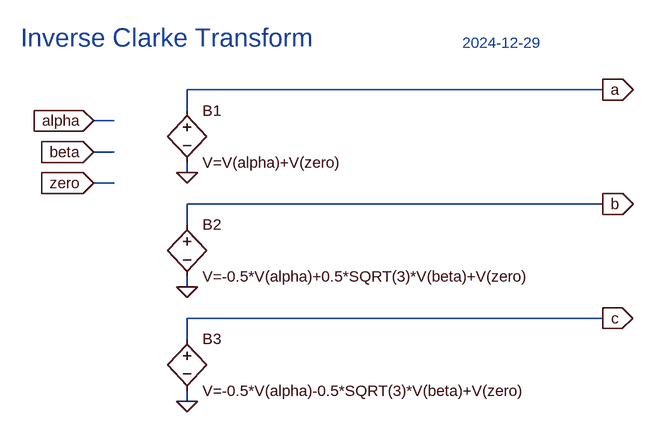
[diagram p0: schematic CLARKEinv.asc]
CLARKEinv.asc, the LTspice schematic file:
Version 4
SHEET 1 880 680
WIRE 528 80 -112 80
WIRE -112 112 -112 80
WIRE -224 128 -256 128
WIRE -224 176 -256 176
WIRE -112 208 -112 192
WIRE -224 224 -256 224
WIRE 528 256 -112 256
WIRE -112 288 -112 256
WIRE -112 384 -112 368
WIRE 528 432 -112 432
WIRE -112 464 -112 432
WIRE -112 560 -112 544
FLAG -112 208 0
FLAG 528 80 a
IOPIN 528 80 Out
FLAG -256 128 alpha
IOPIN -256 128 In
FLAG -256 176 beta
IOPIN -256 176 In
FLAG -256 224 zero
IOPIN -256 224 In
FLAG -112 384 0
FLAG 528 256 b
IOPIN 528 256 Out
FLAG -112 560 0
FLAG 528 432 c
IOPIN 528 432 Out
SYMBOL bv -112 96 R0
SYMATTR InstName B1
SYMATTR Value V=V(alpha)+V(zero)
SYMBOL bv -112 272 R0
SYMATTR InstName B2
SYMATTR Value V=-0.5*V(alpha)+0.5*SQRT(3)*V(beta)+V(zero)
SYMBOL bv -112 448 R0
SYMATTR InstName B3
SYMATTR Value V=-0.5*V(alpha)-0.5*SQRT(3)*V(beta)+V(zero)
TEXT -368 0 Left 4 ;Inverse Clarke Transform
TEXT 312 8 Left 2 ;2024-12-29

The netlist it stands for:
* CLARKEinv.asc
B1 a 0 V=V(alpha)+V(zero)
B2 b 0 V=-0.5*V(alpha)+0.5*SQRT(3)*V(beta)+V(zero)
B3 c 0 V=-0.5*V(alpha)-0.5*SQRT(3)*V(beta)+V(zero)
* Inverse Clarke Transform
* 2024-12-29
.backanno
.end